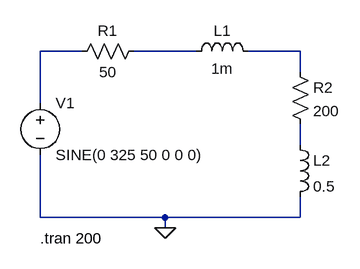
[diagram p0: schematic PowerFactor_Correction.asc]
PowerFactor_Correction.asc, the LTspice schematic file:
Version 4
SHEET 1 880 680
WIRE 64 80 0 80
WIRE 240 80 144 80
WIRE 400 80 320 80
WIRE 400 112 400 80
WIRE 0 160 0 80
WIRE 400 224 400 192
WIRE 0 336 0 240
WIRE 192 336 0 336
WIRE 400 336 400 304
WIRE 400 336 192 336
WIRE 192 352 192 336
FLAG 192 352 0
SYMBOL res 160 64 R90
WINDOW 0 0 56 VBottom 2
WINDOW 3 32 56 VTop 2
SYMATTR InstName R1
SYMATTR Value 50
SYMBOL res 384 96 R0
SYMATTR InstName R2
SYMATTR Value 200
SYMBOL ind 224 96 R270
WINDOW 0 32 56 VTop 2
WINDOW 3 5 56 VBottom 2
SYMATTR InstName L1
SYMATTR Value 1m
SYMBOL ind 384 208 R0
SYMATTR InstName L2
SYMATTR Value 0.5
SYMBOL voltage 0 144 R0
WINDOW 123 0 0 Left 0
WINDOW 39 0 0 Left 0
SYMATTR InstName V1
SYMATTR Value SINE(0 325 50 0 0 0)
TEXT 0 368 Left 2 !.tran 200

The netlist it stands for:
* PowerFactor_Correction.asc
R1 N002 N001 50
R2 N003 N004 200
L1 N002 N003 1m
L2 N004 0 0.5
V1 N001 0 SINE(0 325 50 0 0 0)
.tran 200
.backanno
.end